# Altium schematic sheet PIC18LF25K50_PINOUT.SchDoc
size B; SheetNumber: 5; SheetTotal: 5
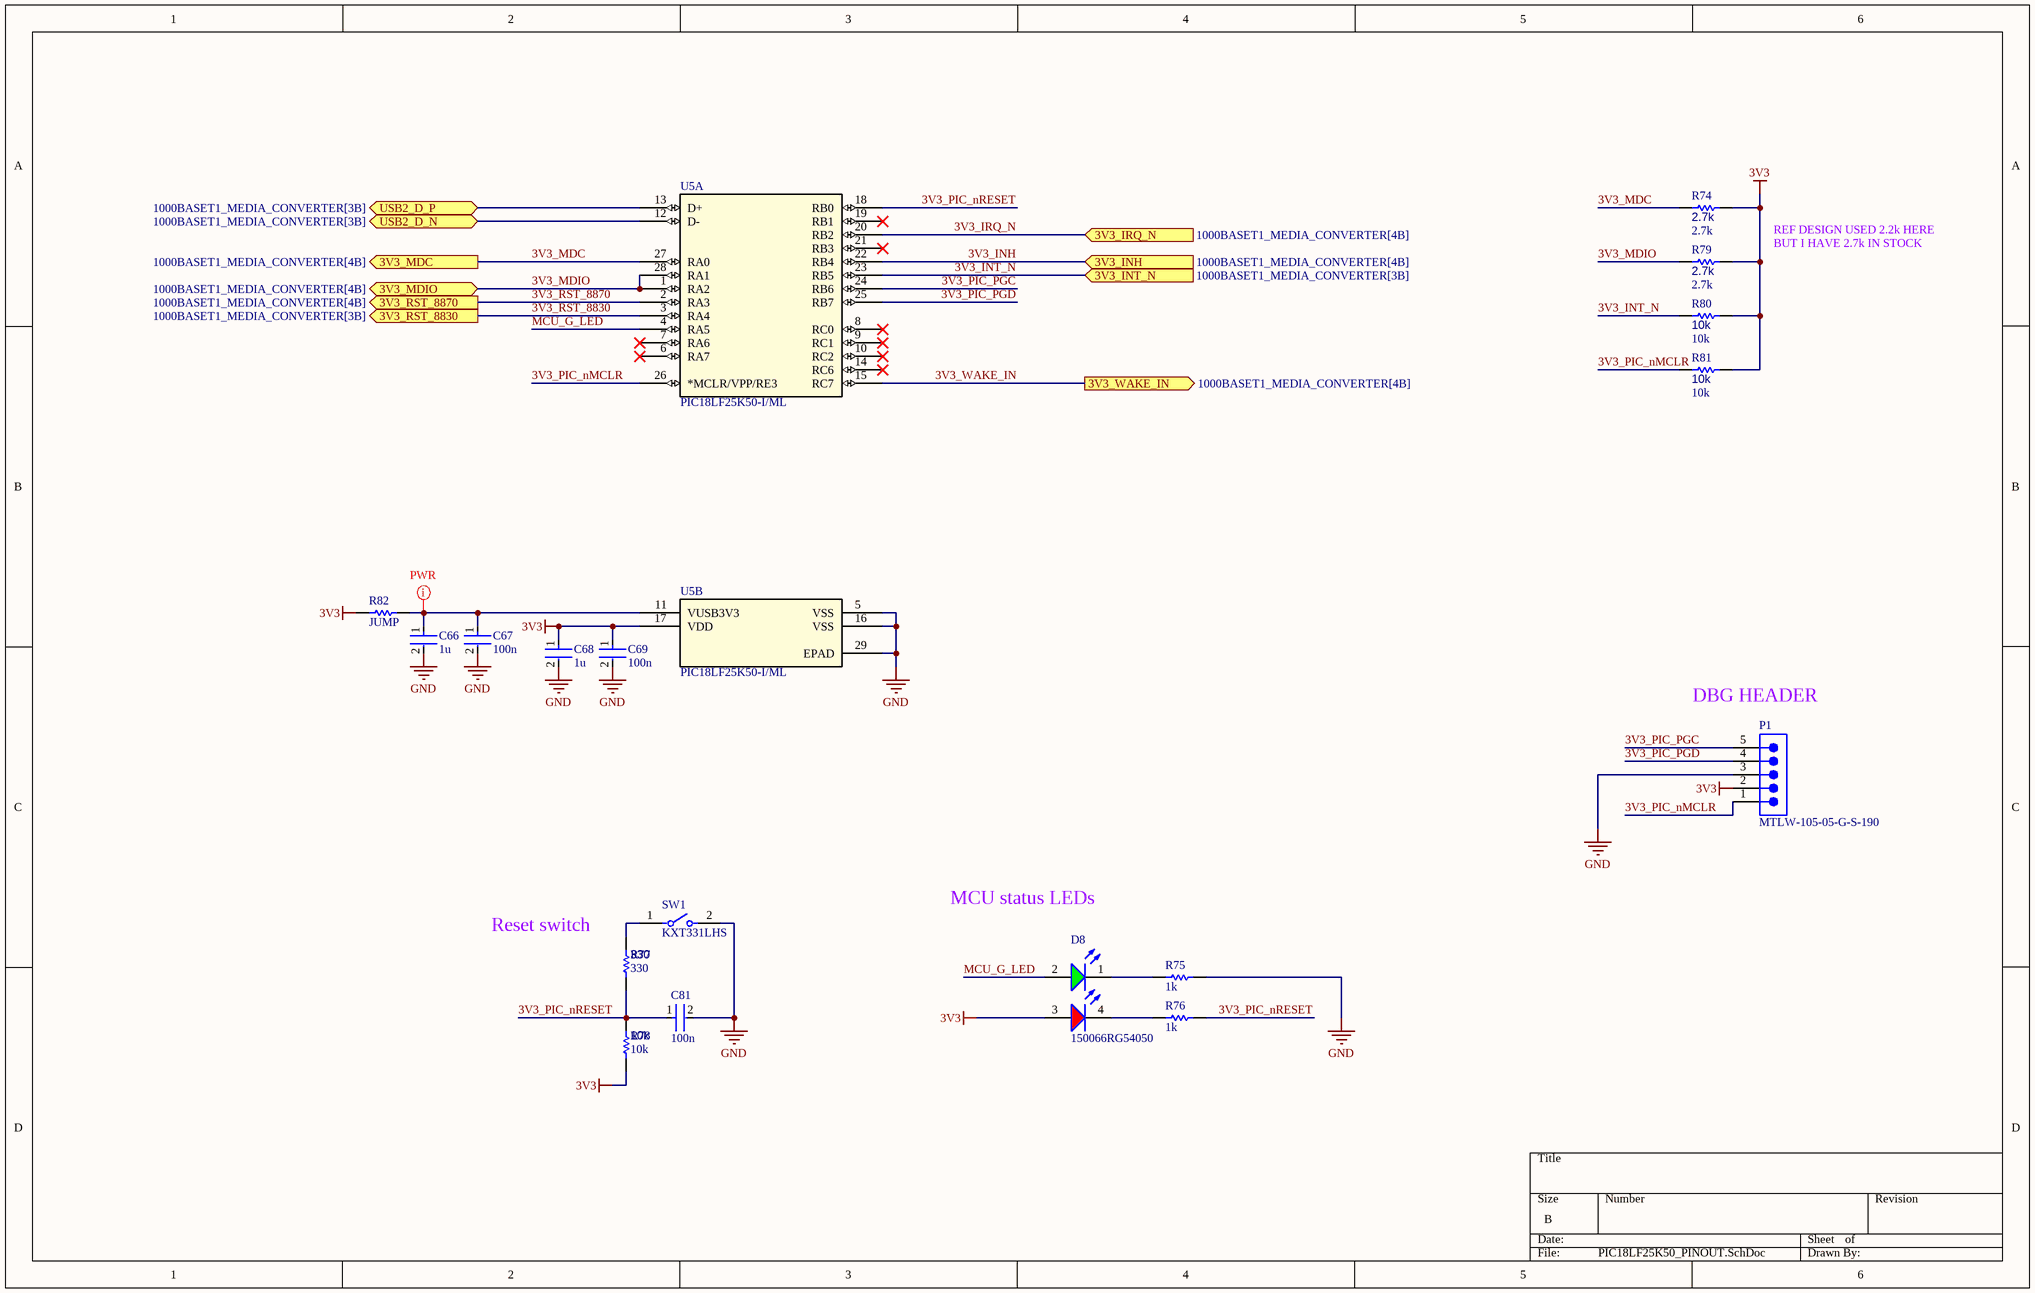
[diagram p0: PIC18LF25K50_PINOUT.SchDoc]

## Parts
C66  1u  [FP-0402-L_1_0_0_05-W_0_5-IPC_A]
C67  100n  [FP-0402-L_1_0_0_05-W_0_5-IPC_A]
C68  1u  [FP-0402-L_1_0_0_05-W_0_5-IPC_A]
C69  100n  [FP-0402-L_1_0_0_05-W_0_5-IPC_A]
C81  100n  [FP-0402-L_1_0_0_05-W_0_5-IPC_A]
D8  150066RG54050  [WL-SBCD_0606]
P1  MTLW-105-05-G-S-190  [SMTC-MTLW-105-05-X-S-190]
R74  2.7k  [R0603B]
R75  1k  [R0603B]
R76  1k  [R0603B]
R77  330  [R0603B]
R78  10k  [R0603B]
R79  2.7k  [R0603B]
R80  10k  [R0603B]
R81  10k  [R0603B]
R82  JUMP  [R0603B]
SW1  KXT331LHS  [FP-KXT331LHS-MFG]
U5  PIC18LF25K50-I/ML  [QFN65P600X600X100_HS-29N]  (parts A,B of 2)

## Ports
3V3_INH (in, see 1000BASET1_MEDIA_CONVERTER[4B]), 3V3_INT_N (in, see 1000BASET1_MEDIA_CONVERTER[3B]), 3V3_IRQ_N (in, see 1000BASET1_MEDIA_CONVERTER[4B]), 3V3_MDC (out, see 1000BASET1_MEDIA_CONVERTER[4B]), 3V3_MDIO (bidir, see 1000BASET1_MEDIA_CONVERTER[4B]), 3V3_RST_8830 (out, see 1000BASET1_MEDIA_CONVERTER[3B]), 3V3_RST_8870 (out, see 1000BASET1_MEDIA_CONVERTER[4B]), 3V3_WAKE_IN (out, see 1000BASET1_MEDIA_CONVERTER[4B]), USB2_D_N (bidir, see 1000BASET1_MEDIA_CONVERTER[3B]), USB2_D_P (bidir, see 1000BASET1_MEDIA_CONVERTER[3B])

## Nets
3V3: C68.1 C69.1 D8.3(A) P1.2 R74.1 R78.1 R79.2 R80.2 R81.2 R82.1 U5.17(VDD)
GND: C66.2 C67.2 C68.2 C69.2 C81.2 P1.3 R75.1 SW1.2 U5.5(VSS) U5.16(VSS) U5.29(EPAD)
3V3_INH: U5.22(RB4) ; port 3V3_INH
3V3_INT_N: R80.1 U5.23(RB5) ; port 3V3_INT_N
3V3_IRQ_N: U5.20(RB2) ; port 3V3_IRQ_N
3V3_MDC: R74.2 U5.27(RA0) ; port 3V3_MDC
3V3_MDIO: R79.1 U5.1(RA2) U5.28(RA1) ; port 3V3_MDIO
3V3_PIC_nMCLR: P1.1 R81.1 U5.26(*MCLR/VPP/RE3)
3V3_PIC_nRESET: C81.1 R76.1 R77.1 R78.2 U5.18(RB0)
3V3_PIC_PGC: P1.5 U5.24(RB6)
3V3_PIC_PGD: P1.4 U5.25(RB7)
3V3_RST_8830: U5.3(RA4) ; port 3V3_RST_8830
3V3_RST_8870: U5.2(RA3) ; port 3V3_RST_8870
3V3_WAKE_IN: U5.15(RC7) ; port 3V3_WAKE_IN
MCU_G_LED: D8.2(A) U5.4(RA5)
USB2_D_N: U5.12(D-) ; port USB2_D_N
USB2_D_P: U5.13(D+) ; port USB2_D_P
NetC66_1: C66.1 C67.1 R82.2 U5.11(VUSB3V3)
NetD8_1: D8.1(K) R75.2
NetD8_4: D8.4(K) R76.2
NetR77_2: R77.2 SW1.1

Not connected (* = marked no-connect by the designer): U5 6(RA7)* 7(RA6)* 8(RC0)* 9(RC1)* 10(RC2)* 14(RC6)* 19(RB1)* 21(RB3)*

## Layout directives
net class PWR: NetC66_1

## Notes on the sheet
- REF DESIGN USED 2.2k HERE BUT I HAVE 2.7k IN STOCK
- (near P1) DBG HEADER
- MCU status LEDs
- (near R77) Reset switch

## Library data of the parts
C66-C69 C81 = CMP-001-00058-1: LARGE PADS, 0402 CAP, CHANGE COMMENT TO MATCH REAL P/N; Capacitor Type: Ceramic; Min Operating Temperature: -55°C; Mounting Technology: Surface Mount; Pins: 2; Case/Package: 0402; RoHS Compliant: Yes; Max Operating Temperature: 85°C
  C66 C68: Value: 1u
  C67 C69 C81: Value: 100n
D8 = CMP-004-00040-2: Led, Red/Grn, 180Mcd/230Mcd, 624Nm/525Nm Rohs Compliant: Yes; Source: rgled.SchLib; Component Type: Standard; Design Item ID: CMP-004-00034-2; Pins: 4
P1 = CMP-1024-00076-1: Low Profile .025" SQ Post Header, Through-hole, Vertical, -55 to 125 degC, 2.54 mm Pitch, 5-Pin, Male, RoHS; Manufacturer: Samtec; Pitch: 2.54 mm; ComponentLink3Description: Package Specification; ComponentLink1Description: Manufacturer URL; ComponentLink1URL: http://www.samtec.com; PartNumber: MTLW-105-05-G-S-190; Mounting Technology: Through-hole; Orientation: Vertical; ComponentLink3URL: http://www.samtec.com/documents/webfiles/cpdf/MTLW-1XX-XX-XX-X-XXX-XX-XX-MKT1.pdf; PackageReference: MTLW-105-05-X-S-190; ComponentLink2URL: http://www.samtec.com/documents/webfiles/pdf/MTLW_TH.PDF; ComponentLink2Description: Datasheet; PackageDescription: Low Profile Terminal Assembly; Temperature Range: -55 to 125 degC; DatasheetVersion: F-214; RoHS: True; PackageVersion: T, 6/1991
R74-R81 = CMP-009-00002-14: Resistor
  R74 R79: Value: 2.7k
  R75 R76: Value: 1k
  R77: Value: 330
  R78 R80 R81: Value: 10k
R82 = CMP-009-00002-14: Resistor; Value: 0
SW1 = CMP-10040-000029-1: SWITCH TACTILE SPST-NO 0.02A 15V; Operating Force: 240gf; Switch Travel: 0.13mm; Illumination Type: Non-Illuminated; Throw Configuration: SPST; Number of Ports: 1; Current Rating: 5A; Mechanical Life: 500000Cycles; Switch Function: Off-Mom; Connector Type: USB; Actuator Type: Standard; Gender: Receptacle; Number of Contacts: 24; Contact Plating: Gold; Insulation Color: Black; Min Operating Temperature: -40°C; Packaging: Tape and Reel; Flammability Rating: UL94 V-0; Max Operating Temperature: 85°C; Termination: Solder; Mount: Surface Mount
U5 = CMP-020-00021-1: MCU 8-bit PIC18 PIC RISC 32KB Flash 2.5V/3.3V 28-Pin QFN EP Tube - Rail/Tube; Max Supply Voltage: 3.6V; RAM Size: 2kB; Interface: I2C, SPI, UART, USART, USB; Min Supply Voltage: 1.8V; Pins: 28; Case/Package: QFN; Max Operating Temperature: 85°C; Min Operating Temperature: -40°C; Mounting Technology: Surface Mount